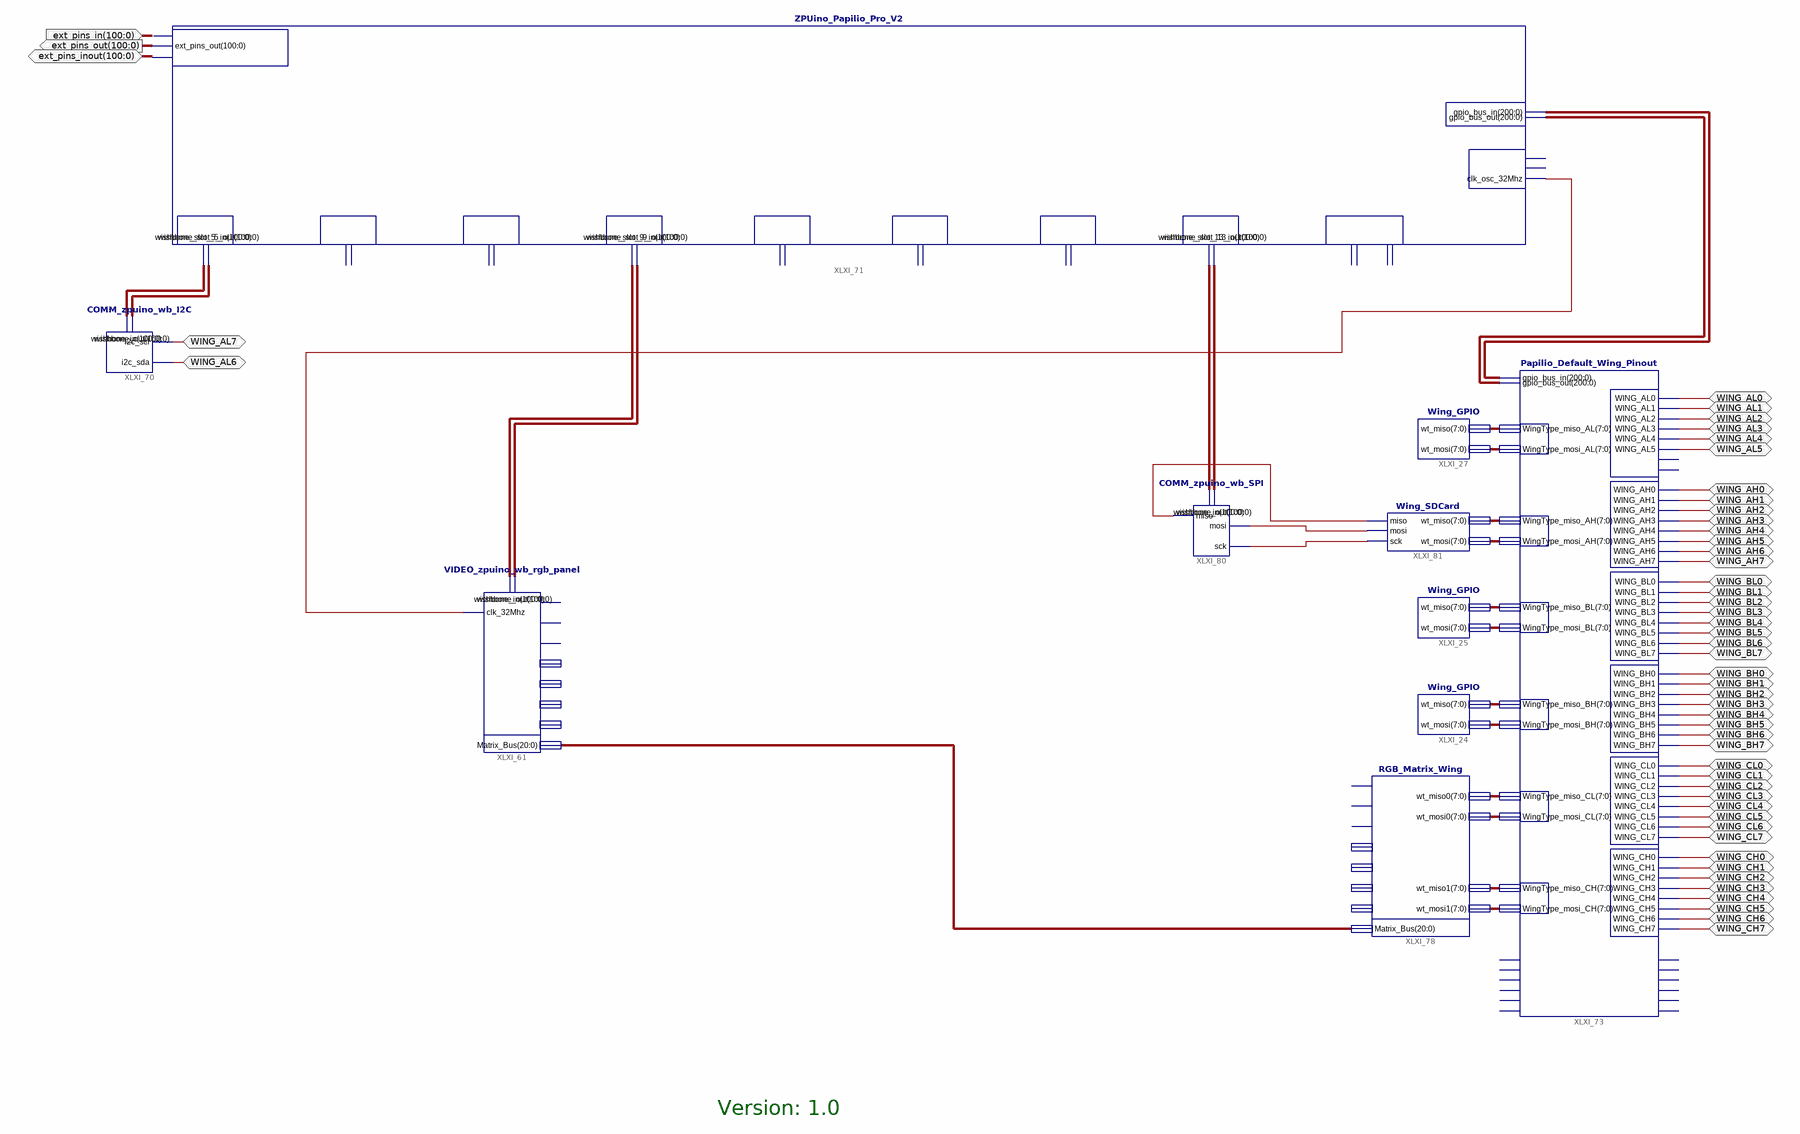
[diagram p0: schematic sheet 1]
// Xilinx ISE schematic Papilio_Pro.sch (spartan6) as structural Verilog: 10 symbols, 51 ports
module Papilio_Pro (
  input  [100:0] ext_pins_in,
  inout  [100:0] ext_pins_inout,
  inout  WING_AL6,
  inout  WING_AL7,
  inout  WING_AL0,
  inout  WING_AL1,
  inout  WING_AL2,
  inout  WING_AL3,
  inout  WING_AL4,
  inout  WING_AL5,
  inout  WING_AH0,
  inout  WING_AH1,
  inout  WING_AH2,
  inout  WING_AH3,
  inout  WING_AH4,
  inout  WING_AH5,
  inout  WING_AH6,
  inout  WING_AH7,
  inout  WING_BL0,
  inout  WING_BL1,
  inout  WING_BL2,
  inout  WING_BL3,
  inout  WING_BL4,
  inout  WING_BL5,
  inout  WING_BL6,
  inout  WING_BL7,
  inout  WING_BH0,
  inout  WING_BH1,
  inout  WING_BH2,
  inout  WING_BH3,
  inout  WING_BH4,
  inout  WING_BH5,
  inout  WING_BH6,
  inout  WING_BH7,
  inout  WING_CL0,
  inout  WING_CL1,
  inout  WING_CL2,
  inout  WING_CL3,
  inout  WING_CL4,
  inout  WING_CL5,
  inout  WING_CL6,
  inout  WING_CL7,
  inout  WING_CH0,
  inout  WING_CH1,
  inout  WING_CH2,
  inout  WING_CH3,
  inout  WING_CH4,
  inout  WING_CH5,
  inout  WING_CH6,
  inout  WING_CH7,
  output [100:0] ext_pins_out
);

  wire XLXN_634, XLXN_662, XLXN_663, XLXN_664;
  wire [7:0] XLXN_329, XLXN_330, XLXN_331, XLXN_332, XLXN_335, XLXN_336, XLXN_651, XLXN_652, XLXN_653,
       XLXN_654, XLXN_660, XLXN_661;
  wire [20:0] XLXN_655;
  wire [100:0] XLXN_622, XLXN_623, XLXN_626, XLXN_627, XLXN_658, XLXN_659;
  wire [200:0] XLXN_598, XLXN_599;

  Wing_GPIO XLXI_27 (.wt_miso(XLXN_335), .wt_mosi(XLXN_336));
  Wing_GPIO XLXI_25 (.wt_miso(XLXN_331), .wt_mosi(XLXN_332));
  Wing_GPIO XLXI_24 (.wt_miso(XLXN_329), .wt_mosi(XLXN_330));
  VIDEO_zpuino_wb_rgb_panel XLXI_61 (
    .wishbone_out(XLXN_623), .wishbone_in(XLXN_622), .clk_32Mhz(XLXN_634), .Matrix_Bus(XLXN_655));  // open: R, G, B, COL, CLK, STB, OE
  COMM_zpuino_wb_I2C XLXI_70 (.i2c_scl(WING_AL7), .i2c_sda(WING_AL6), .wishbone_in(XLXN_626), .wishbone_out(XLXN_627));
  ZPUino_Papilio_Pro_V2 XLXI_71 (
    .gpio_bus_out(XLXN_599), .gpio_bus_in(XLXN_598), .clk_osc_32Mhz(XLXN_634), .ext_pins_in(ext_pins_in),
    .ext_pins_out(ext_pins_out), .ext_pins_inout(ext_pins_inout), .wishbone_slot_5_out(XLXN_627),
    .wishbone_slot_5_in(XLXN_626), .wishbone_slot_9_in(XLXN_622), .wishbone_slot_9_out(XLXN_623),
    .wishbone_slot_13_in(XLXN_658), .wishbone_slot_13_out(XLXN_659));  // open: clk_96Mhz, clk_1Mhz, wishbone_slot_6_in, wishbone_slot_6_out, wishbone_slot_8_in, wishbone_slot_8_out, wishbone_slot_10_in, wishbone_slot_10_out, wishbone_slot_11_in, wishbone_slot_11_out, wishbone_slot_12_in, wishbone_slot_12_out, wishbone_slot_14_in, wishbone_slot_14_out, wishbone_slot_video_in, wishbone_slot_video_out
  Papilio_Default_Wing_Pinout XLXI_73 (
    .WING_AH0(WING_AH0), .WING_AH1(WING_AH1), .WING_AH2(WING_AH2), .WING_AH3(WING_AH3), .WING_AH4(WING_AH4),
    .WING_AH5(WING_AH5), .WING_AH6(WING_AH6), .WING_AH7(WING_AH7), .WING_AL0(WING_AL0), .WING_AL1(WING_AL1),
    .WING_AL2(WING_AL2), .WING_AL3(WING_AL3), .WING_AL4(WING_AL4), .WING_AL5(WING_AL5), .WING_BH0(WING_BH0),
    .WING_BH1(WING_BH1), .WING_BH2(WING_BH2), .WING_BH3(WING_BH3), .WING_BH4(WING_BH4), .WING_BH5(WING_BH5),
    .WING_BH6(WING_BH6), .WING_BH7(WING_BH7), .WING_BL0(WING_BL0), .WING_BL1(WING_BL1), .WING_BL2(WING_BL2),
    .WING_BL3(WING_BL3), .WING_BL4(WING_BL4), .WING_BL5(WING_BL5), .WING_BL6(WING_BL6), .WING_BL7(WING_BL7),
    .WING_CL0(WING_CL0), .WING_CL1(WING_CL1), .WING_CL2(WING_CL2), .WING_CL3(WING_CL3), .WING_CL4(WING_CL4),
    .WING_CL5(WING_CL5), .WING_CL6(WING_CL6), .WING_CL7(WING_CL7), .WING_CH0(WING_CH0), .WING_CH1(WING_CH1),
    .WING_CH2(WING_CH2), .WING_CH3(WING_CH3), .WING_CH4(WING_CH4), .WING_CH5(WING_CH5), .WING_CH6(WING_CH6),
    .WING_CH7(WING_CH7), .gpio_bus_out(XLXN_599), .gpio_bus_in(XLXN_598), .WingType_miso_BH(XLXN_329),
    .WingType_miso_BL(XLXN_331), .WingType_miso_AH(XLXN_660), .WingType_mosi_BL(XLXN_332),
    .WingType_mosi_BH(XLXN_330), .WingType_mosi_CL(XLXN_652), .WingType_mosi_AH(XLXN_661),
    .WingType_miso_CL(XLXN_651), .WingType_miso_CH(XLXN_653), .WingType_mosi_CH(XLXN_654),
    .WingType_mosi_AL(XLXN_336), .WingType_miso_AL(XLXN_335));  // open: WING_AL6, WING_AL7, Flex_Pin_out_0, Flex_Pin_out_1, Flex_Pin_out_2, Flex_Pin_out_3, Flex_Pin_out_4, Flex_Pin_out_5, Flex_Pin_in_0, Flex_Pin_in_1, Flex_Pin_in_2, Flex_Pin_in_3, Flex_Pin_in_4, Flex_Pin_in_5
  RGB_Matrix_Wing XLXI_78 (
    .wt_miso0(XLXN_651), .wt_mosi0(XLXN_652), .wt_miso1(XLXN_653), .wt_mosi1(XLXN_654), .Matrix_Bus(XLXN_655));  // open: CLK, STB, OE, R, G, B, COL
  COMM_zpuino_wb_SPI XLXI_80 (
    .miso(XLXN_662), .sck(XLXN_664), .mosi(XLXN_663), .wishbone_in(XLXN_658), .wishbone_out(XLXN_659));
  Wing_SDCard XLXI_81 (.wt_miso(XLXN_660), .wt_mosi(XLXN_661), .sck(XLXN_664), .mosi(XLXN_663), .miso(XLXN_662));

  // Notes on the sheet:
  //   Version: 1.0
endmodule
